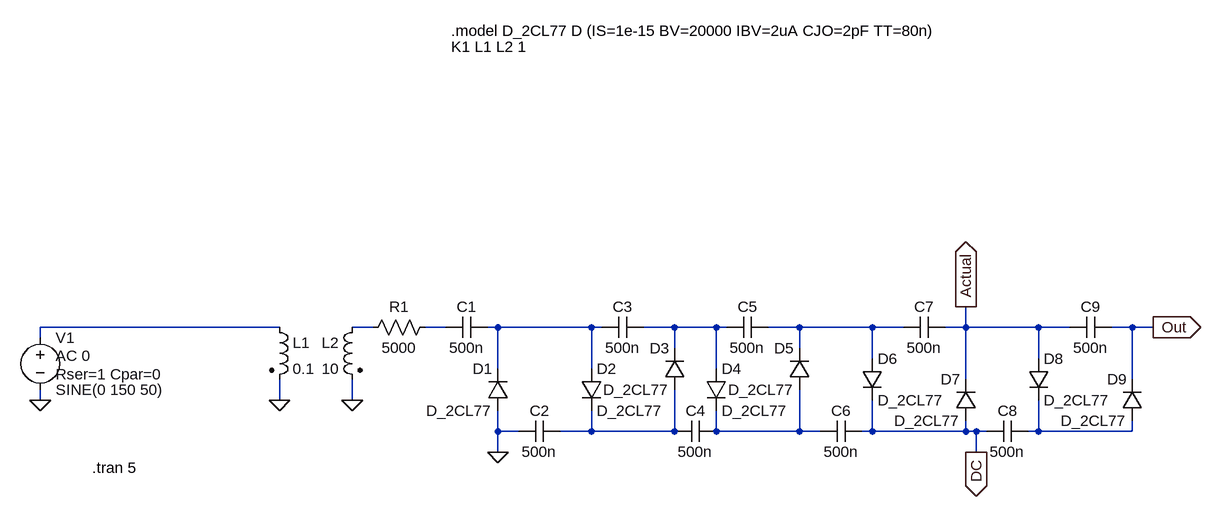
[diagram p0: schematic HIGH_Voltage_Power_Supply.asc]
HIGH_Voltage_Power_Supply.asc, the LTspice schematic file:
Version 4
SHEET 1 1252 680
WIRE -208 -96 -576 -96
WIRE -64 -96 -96 -96
WIRE 48 -96 16 -96
WIRE 128 -96 112 -96
WIRE 272 -96 128 -96
WIRE 288 -96 272 -96
WIRE 400 -96 352 -96
WIRE 464 -96 400 -96
WIRE 480 -96 464 -96
WIRE 592 -96 544 -96
WIRE 704 -96 592 -96
WIRE 752 -96 704 -96
WIRE 848 -96 848 -128
WIRE 848 -96 816 -96
WIRE 960 -96 848 -96
WIRE 1008 -96 960 -96
WIRE 1104 -96 1072 -96
WIRE 1136 -96 1104 -96
WIRE -576 -80 -576 -96
WIRE 400 -64 400 -96
WIRE 592 -64 592 -96
WIRE 704 -48 704 -96
WIRE 960 -48 960 -96
WIRE 128 -32 128 -96
WIRE 272 -32 272 -96
WIRE 464 -32 464 -96
WIRE 848 -16 848 -96
WIRE 1104 -16 1104 -96
WIRE -576 16 -576 0
WIRE -208 16 -208 -16
WIRE -96 16 -96 -16
WIRE 128 64 128 32
WIRE 160 64 128 64
WIRE 272 64 272 32
WIRE 272 64 224 64
WIRE 400 64 400 0
WIRE 400 64 272 64
WIRE 464 64 464 32
WIRE 592 64 592 0
WIRE 592 64 464 64
WIRE 624 64 592 64
WIRE 704 64 704 16
WIRE 704 64 688 64
WIRE 848 64 848 48
WIRE 848 64 704 64
WIRE 864 64 848 64
WIRE 880 64 864 64
WIRE 960 64 960 16
WIRE 960 64 944 64
WIRE 1104 64 1104 48
WIRE 1104 64 960 64
WIRE 128 96 128 64
WIRE 864 96 864 64
FLAG -208 16 0
FLAG -96 16 0
FLAG -576 16 0
FLAG 128 96 0
FLAG 1136 -96 Out
IOPIN 1136 -96 Out
FLAG 864 96 DC
IOPIN 864 96 Out
FLAG 848 -128 Actual
IOPIN 848 -128 Out
SYMBOL cap 112 -112 R90
WINDOW 0 0 32 VBottom 2
WINDOW 3 32 32 VTop 2
SYMATTR InstName C1
SYMATTR Value 500n
SYMATTR SpiceLine V=3K Irms=0 Rser=0.1877 Lser=395p
SYMBOL cap 224 48 R90
WINDOW 0 0 32 VBottom 2
WINDOW 3 32 32 VTop 2
SYMATTR InstName C2
SYMATTR Value 500n
SYMATTR SpiceLine V=3K Irms=0 Rser=0.1877 Lser=395p
SYMBOL diode 256 -32 R0
SYMATTR InstName D2
SYMATTR Value D_2CL77
SYMBOL diode 144 32 R180
WINDOW 0 24 64 Left 2
WINDOW 3 24 0 Left 2
SYMATTR InstName D1
SYMATTR Value D_2CL77
SYMBOL cap 352 -112 R90
WINDOW 0 0 32 VBottom 2
WINDOW 3 32 32 VTop 2
SYMATTR InstName C3
SYMATTR Value 500n
SYMATTR SpiceLine V=3K Irms=0 Rser=0.1877 Lser=395p
SYMBOL diode 416 0 R180
WINDOW 0 24 64 Left 2
WINDOW 3 24 0 Left 2
SYMATTR InstName D3
SYMATTR Value D_2CL77
SYMBOL cap 464 48 R90
WINDOW 0 0 32 VBottom 2
WINDOW 3 32 32 VTop 2
SYMATTR InstName C4
SYMATTR Value 500n
SYMATTR SpiceLine V=3K Irms=0 Rser=0.1877 Lser=395p
SYMBOL diode 448 -32 R0
SYMATTR InstName D4
SYMATTR Value D_2CL77
SYMBOL cap 544 -112 R90
WINDOW 0 0 32 VBottom 2
WINDOW 3 32 32 VTop 2
SYMATTR InstName C5
SYMATTR Value 500n
SYMATTR SpiceLine V=3K Irms=0 Rser=0.1877 Lser=395p
SYMBOL diode 608 0 R180
WINDOW 0 24 64 Left 2
WINDOW 3 24 0 Left 2
SYMATTR InstName D5
SYMATTR Value D_2CL77
SYMBOL cap 688 48 R90
WINDOW 0 0 32 VBottom 2
WINDOW 3 32 32 VTop 2
SYMATTR InstName C6
SYMATTR Value 500n
SYMATTR SpiceLine V=3K Irms=0 Rser=0.1877 Lser=395p
SYMBOL cap 816 -112 R90
WINDOW 0 0 32 VBottom 2
WINDOW 3 32 32 VTop 2
SYMATTR InstName C7
SYMATTR Value 500n
SYMATTR SpiceLine V=3K Irms=0 Rser=0.1877 Lser=395p
SYMBOL diode 688 -48 R0
SYMATTR InstName D6
SYMATTR Value D_2CL77
SYMBOL diode 864 48 R180
WINDOW 0 24 64 Left 2
WINDOW 3 24 0 Left 2
SYMATTR InstName D7
SYMATTR Value D_2CL77
SYMBOL ind2 -224 -112 R0
SYMATTR InstName L1
SYMATTR Value 0.1
SYMATTR Type ind
SYMBOL ind2 -80 -112 M0
SYMATTR InstName L2
SYMATTR Value 10
SYMATTR Type ind
SYMBOL voltage -576 -96 R0
WINDOW 123 24 44 Left 2
WINDOW 39 24 72 Left 2
SYMATTR Value2 AC 0
SYMATTR SpiceLine Rser=1 Cpar=0
SYMATTR InstName V1
SYMATTR Value SINE(0 150 50)
SYMBOL res 32 -112 R90
WINDOW 0 0 56 VBottom 2
WINDOW 3 32 56 VTop 2
SYMATTR InstName R1
SYMATTR Value 5000
SYMATTR SpiceLine tol=1 pwr=10
SYMBOL cap 944 48 R90
WINDOW 0 0 32 VBottom 2
WINDOW 3 32 32 VTop 2
SYMATTR InstName C8
SYMATTR Value 500n
SYMATTR SpiceLine V=3K Irms=0 Rser=0.1877 Lser=395p
SYMBOL diode 944 -48 R0
SYMATTR InstName D8
SYMATTR Value D_2CL77
SYMBOL cap 1072 -112 R90
WINDOW 0 0 32 VBottom 2
WINDOW 3 32 32 VTop 2
SYMATTR InstName C9
SYMATTR Value 500n
SYMATTR SpiceLine V=3K Irms=0 Rser=0.1877 Lser=395p
SYMBOL diode 1120 48 R180
WINDOW 0 24 64 Left 2
WINDOW 3 24 0 Left 2
SYMATTR InstName D9
SYMATTR Value D_2CL77
TEXT 56 -552 Left 2 !.model D_2CL77 D (IS=1e-15 BV=20000 IBV=2uA CJO=2pF TT=80n)
TEXT 56 -528 Left 2 !K1 L1 L2 1
TEXT -496 120 Left 2 !.tran 5

The netlist it stands for:
* HIGH_Voltage_Power_Supply.asc
C1 N004 N003 500n V=3K Irms=0 Rser=0.1877 Lser=395p
C2 N007 0 500n V=3K Irms=0 Rser=0.1877 Lser=395p
D2 N004 N007 D_2CL77
D1 0 N004 D_2CL77
C3 N005 N004 500n V=3K Irms=0 Rser=0.1877 Lser=395p
D3 N007 N005 D_2CL77
C4 N008 N007 500n V=3K Irms=0 Rser=0.1877 Lser=395p
D4 N005 N008 D_2CL77
C5 N006 N005 500n V=3K Irms=0 Rser=0.1877 Lser=395p
D5 N008 N006 D_2CL77
C6 DC N008 500n V=3K Irms=0 Rser=0.1877 Lser=395p
C7 Actual N006 500n V=3K Irms=0 Rser=0.1877 Lser=395p
D6 N006 DC D_2CL77
D7 DC Actual D_2CL77
L1 N001 0 0.1
L2 N002 0 10
V1 N001 0 SINE(0 150 50) AC 0 Rser=1 Cpar=0
R1 N003 N002 5000 tol=1 pwr=10
C8 N009 DC 500n V=3K Irms=0 Rser=0.1877 Lser=395p
D8 Actual N009 D_2CL77
C9 Out Actual 500n V=3K Irms=0 Rser=0.1877 Lser=395p
D9 N009 Out D_2CL77
.model D D
.lib standard.dio
.model D_2CL77 D (IS=1e-15 BV=20000 IBV=2uA CJO=2pF TT=80n)
K1 L1 L2 1
.tran 5
.backanno
.end